# Altium project FTDI_JTAG_Prog_SOM_Bd.PrjPcb
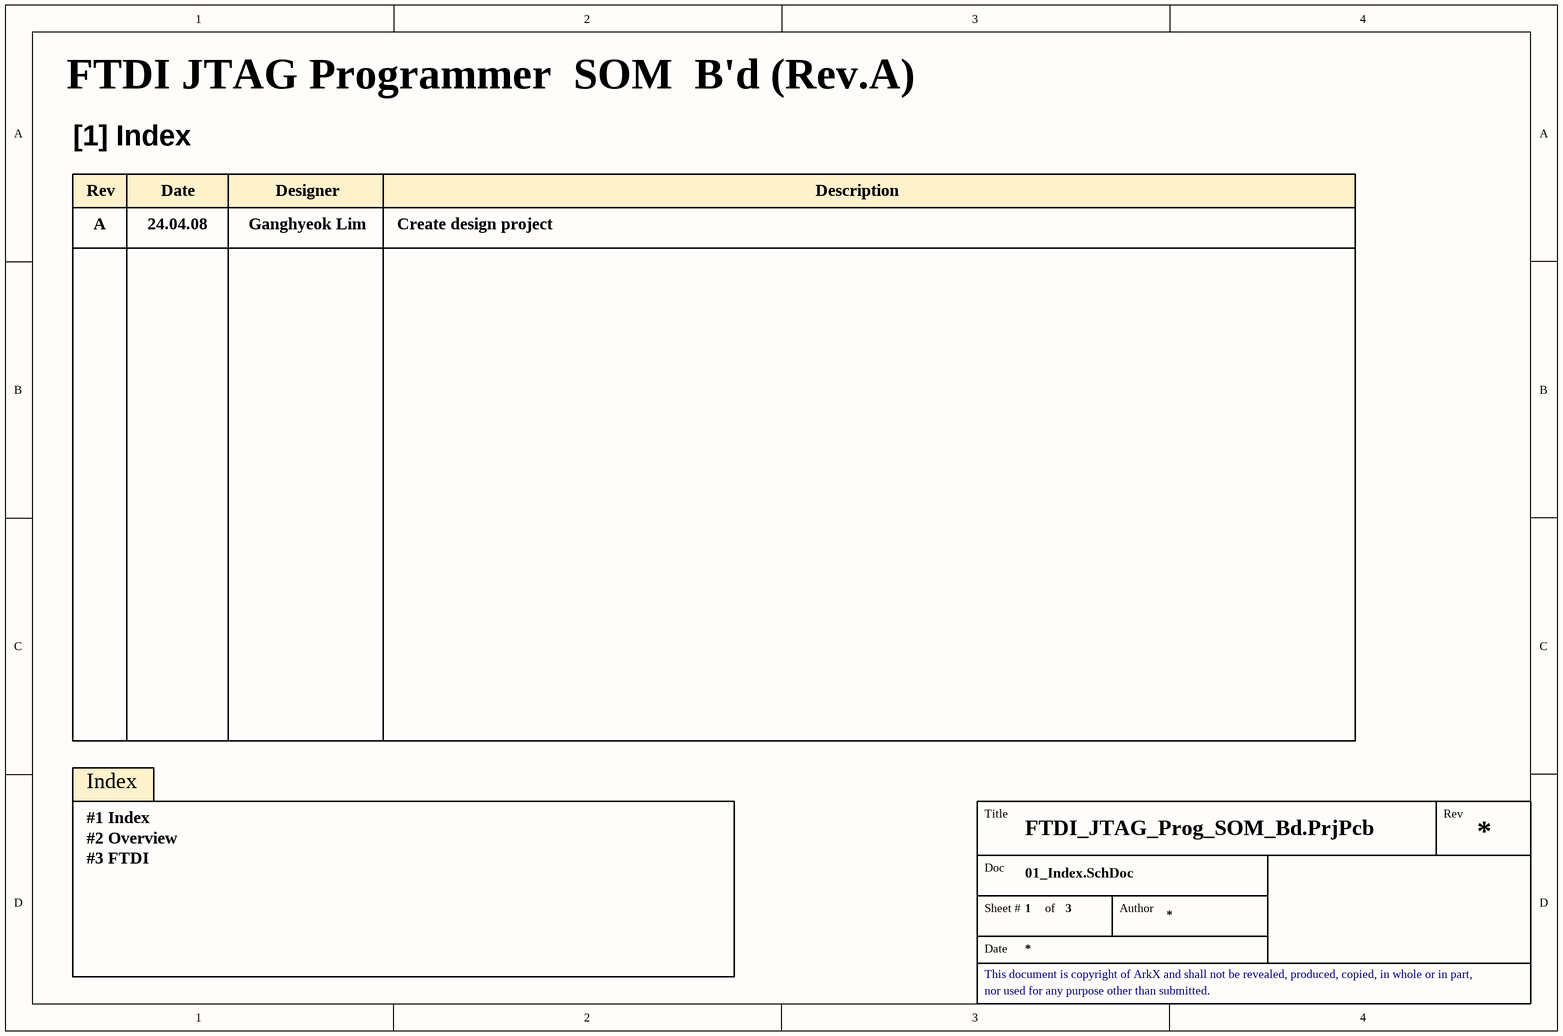
[diagram p0: 01_Index.SchDoc]
3 sheets, 53 parts. Net scope: global (net labels, ports and power ports of the same name join across sheets).
Board file: FTDI_JTAG_Prog_SOM_Bd.PcbDoc
Sheets:
  01_Index.SchDoc
  02_Overview.SchDoc
  03_FTDI.SchDoc

## Sheet 01_Index.SchDoc
size A4; SheetNumber: 1; SheetTotal: 3

### Notes on the sheet
- FTDI JTAG Programmer  SOM  B'd (Rev.A)
- [1] Index
- Rev
- A
- 24.04.08
- Date
- Ganghyeok Lim
- Designer
- Create design project
- Description
- Index
- #1 Index
- #2 Overview
- #3 FTDI
- Title
- Doc
- Sheet #
- of
- Author
- This document is copyright of ArkX and shall not be revealed, produced, copied, in whole or in part,
- nor used for any purpose other than submitted.

## Sheet 02_Overview.SchDoc
size A4; SheetNumber: 2; SheetTotal: 3
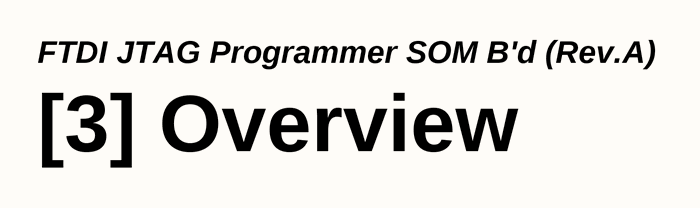
[diagram p1: 02_Overview.SchDoc]

### Notes on the sheet
- FTDI JTAG Programmer SOM B'd (Rev.A)
- [3] Overview
- Title
- Rev
- Doc
- Sheet #
- of
- Author
- This document is copyright of ArkX and shall not be revealed, produced, copied, in whole or in part,
- Date
- nor used for any purpose other than submitted.

## Sheet 03_FTDI.SchDoc
size A3; SheetNumber: 3; SheetTotal: 3
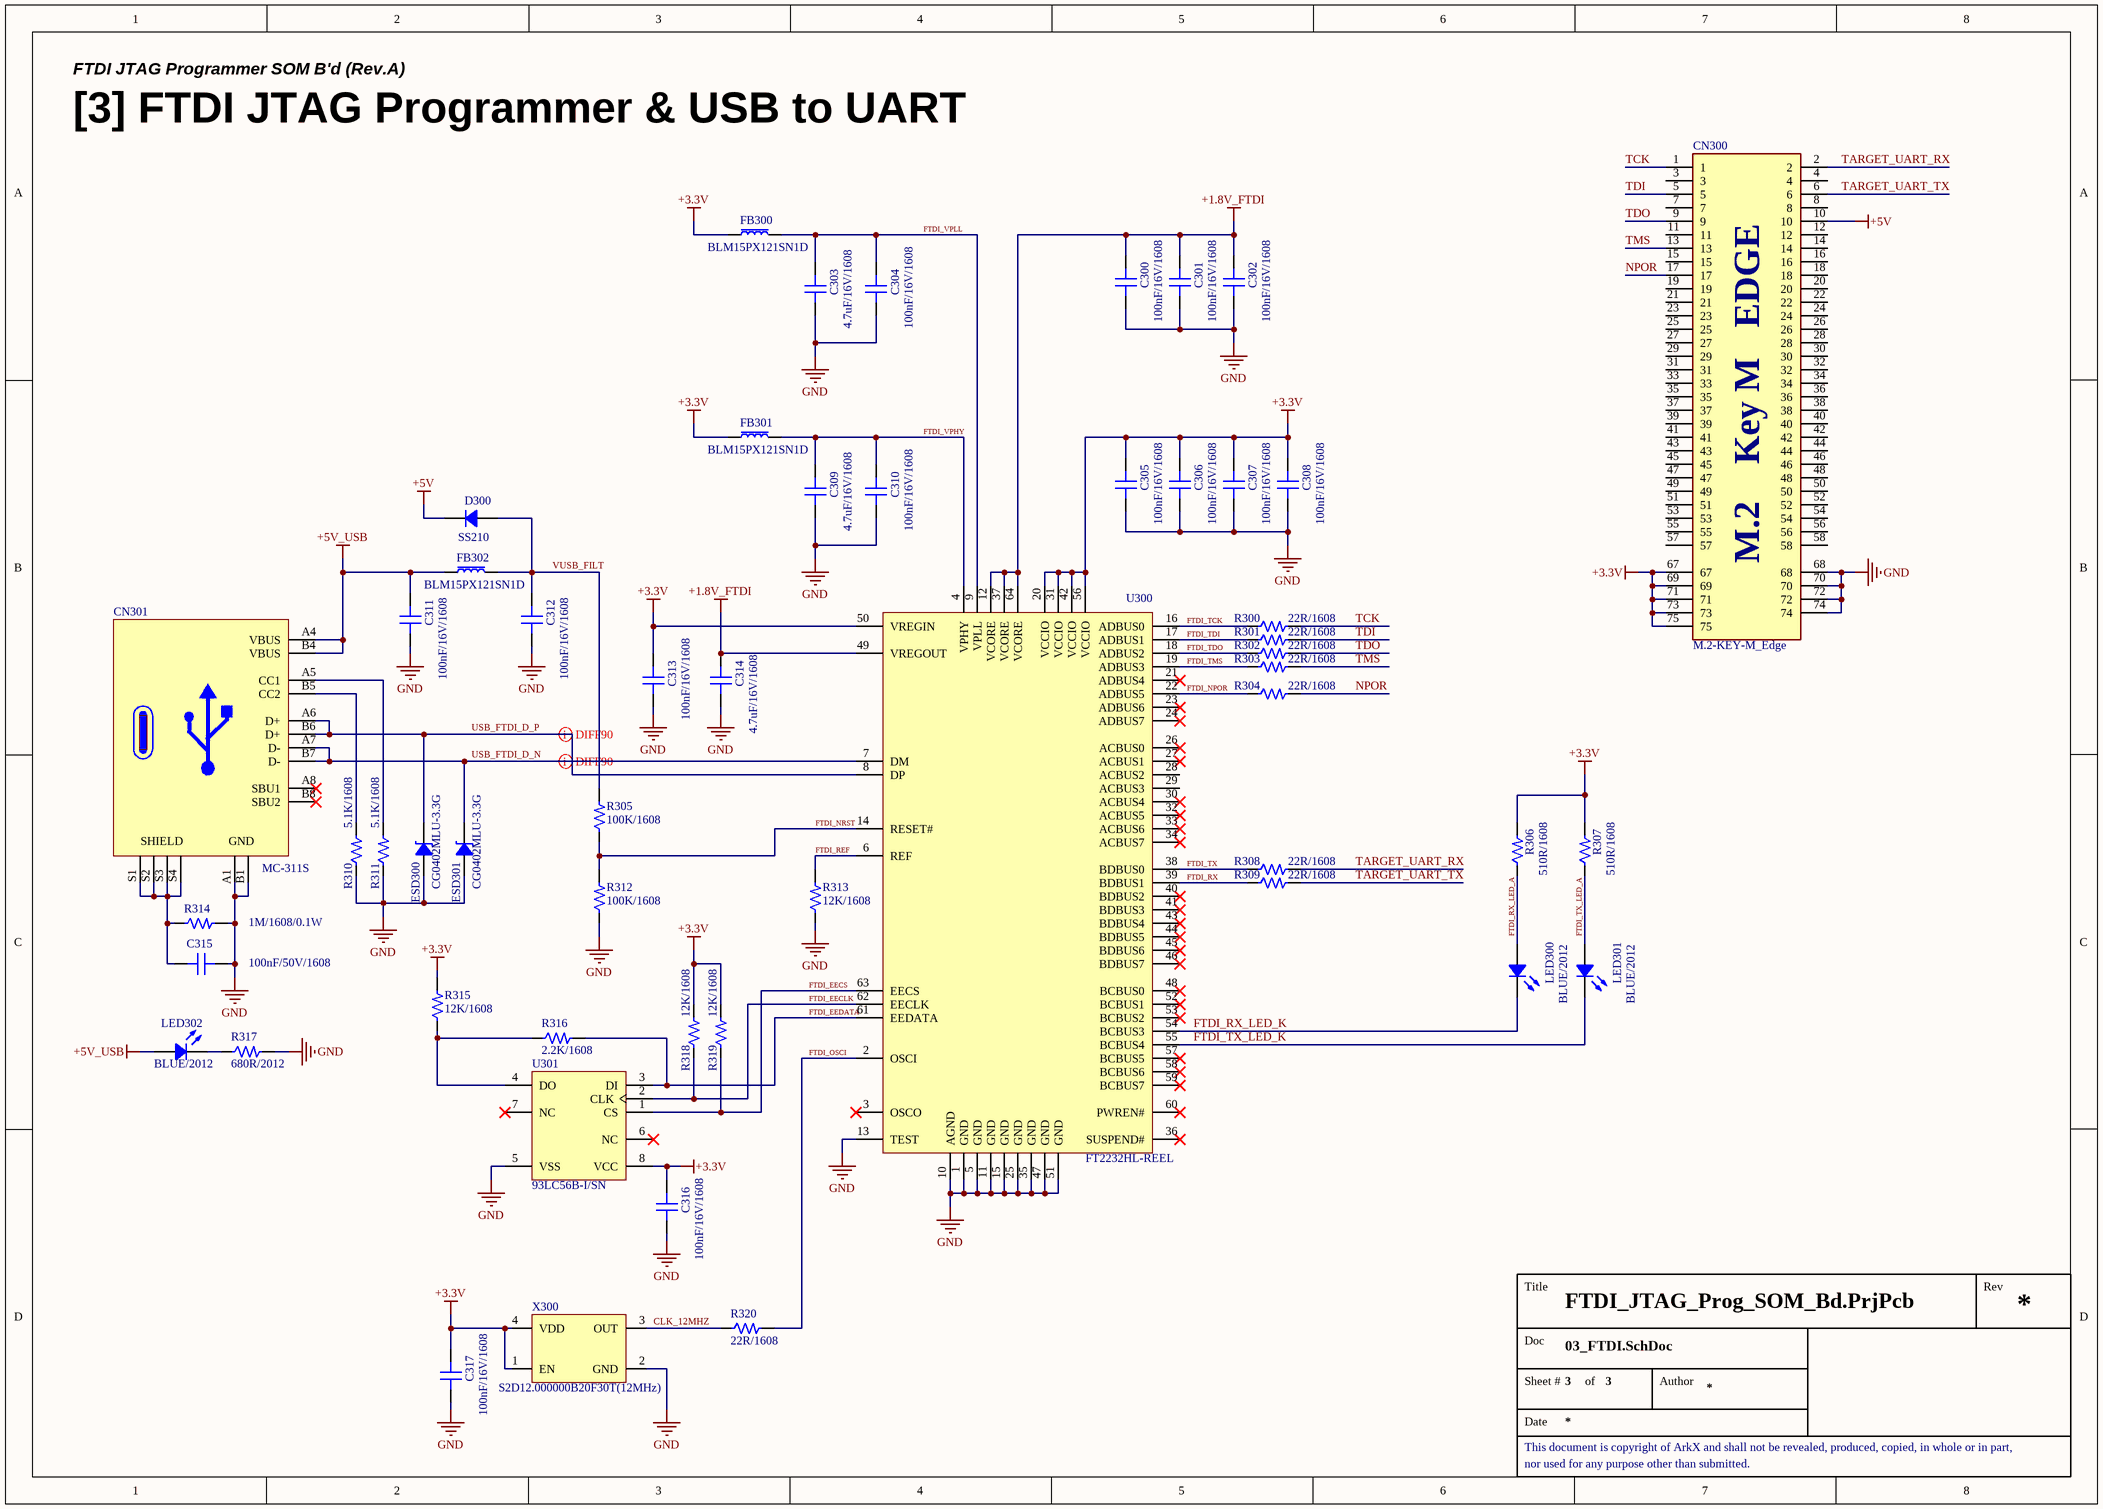
[diagram p2: 03_FTDI.SchDoc]

### Parts
C300  100nF/16V/1608  [CAP 1608 (0603_INCH)]
C301  100nF/16V/1608  [CAP 1608 (0603_INCH)]
C302  100nF/16V/1608  [CAP 1608 (0603_INCH)]
C303  4.7uF/16V/1608  [CAP 1608 (0603_INCH)]
C304  100nF/16V/1608  [CAP 1608 (0603_INCH)]
C305  100nF/16V/1608  [CAP 1608 (0603_INCH)]
C306  100nF/16V/1608  [CAP 1608 (0603_INCH)]
C307  100nF/16V/1608  [CAP 1608 (0603_INCH)]
C308  100nF/16V/1608  [CAP 1608 (0603_INCH)]
C309  4.7uF/16V/1608  [CAP 1608 (0603_INCH)]
C310  100nF/16V/1608  [CAP 1608 (0603_INCH)]
C311  100nF/16V/1608  [CAP 1608 (0603_INCH)]
C312  100nF/16V/1608  [CAP 1608 (0603_INCH)]
C313  100nF/16V/1608  [CAP 1608 (0603_INCH)]
C314  4.7uF/16V/1608  [CAP 1608 (0603_INCH)]
C315  100nF/50V/1608  [CAP 1608 (0603_INCH)]
C316  100nF/16V/1608  [CAP 1608 (0603_INCH)]
C317  100nF/16V/1608  [CAP 1608 (0603_INCH)]
CN300  M.2-KEY-M_Edge  [CON_M.2-KEY-M_MALE_22x80]  (no BOM)
CN301  MC-311S  [CON USB-Type-C (16P)]
D300  SS210  [DIO DO-214AC (SMA)]
ESD300  CG0402MLU-3.3G  [RES 1005 (0402_inch)]
ESD301  CG0402MLU-3.3G  [RES 1005 (0402_inch)]
FB300  BLM15PX121SN1D  [FB 1005 (0402_inch)]
FB301  BLM15PX121SN1D  [FB 1005 (0402_inch)]
FB302  BLM15PX121SN1D  [FB 1005 (0402_inch)]
LED300  BLUE/2012  [LED MHT170RGBCT (BLUE)]
LED301  BLUE/2012  [LED MHT170RGBCT (BLUE)]
LED302  BLUE/2012  [LED MHT170RGBCT (BLUE)]
R300  22R/1608  [RES 1608 (0603_inch)]
R301  22R/1608  [RES 1608 (0603_inch)]
R302  22R/1608  [RES 1608 (0603_inch)]
R303  22R/1608  [RES 1608 (0603_inch)]
R304  22R/1608  [RES 1608 (0603_inch)]
R305  100K/1608  [RES 1608 (0603_inch)]
R306  510R/1608  [RES 1608 (0603_inch)]
R307  510R/1608  [RES 1608 (0603_inch)]
R308  22R/1608  [RES 1608 (0603_inch)]
R309  22R/1608  [RES 1608 (0603_inch)]
R310  5.1K/1608  [RES 1608 (0603_inch)]
R311  5.1K/1608  [RES 1608 (0603_inch)]
R312  100K/1608  [RES 1608 (0603_inch)]
R313  12K/1608  [RES 1608 (0603_inch)]
R314  1M/1608/0.1W  [RES 1608 (0603_inch)]
R315  12K/1608  [RES 1608 (0603_inch)]
R316  2.2K/1608  [RES 1608 (0603_inch)]
R317  680R/2012  [RES 2012 (0805_inch)]
R318  12K/1608  [RES 1608 (0603_inch)]
R319  12K/1608  [RES 1608 (0603_inch)]
R320  22R/1608  [RES 1608 (0603_inch)]
U300  FT2232HL-REEL  [IC_LQFP-64-0.5mm]
U301  93LC56B-I/SN  [IC_SOIC-8 (4.90x3.90mm)]
X300  S2D12.000000B20F30T(12MHz)  [OSC SMD_2.5x2.0 (SCTF)]

### Nets
+1.8V_FTDI: C300.2 C301.2 C302.2 C314.2 U300.12(VCORE) U300.37(VCORE) U300.49(VREGOUT) U300.64(VCORE)
+3.3V: C305.2 C306.2 C307.2 C308.2 C313.2 C316.2 C317.2 CN300.67 CN300.69 CN300.71 CN300.73 CN300.75 FB300.1 FB301.1 R306.2 R307.2 R315.2 R318.2 R319.2 U300.20(VCCIO) U300.31(VCCIO) U300.42(VCCIO) U300.50(VREGIN) U300.56(VCCIO) U301.8(VCC) X300.1(EN) X300.4(VDD)
+5V: CN300.10 D300.2
+5V_USB: C311.2 CN301.A4(VBUS) CN301.B4(VBUS) FB302.1 LED302.4(Common_Anode)
GND: C300.1 C301.1 C302.1 C303.1 C304.1 C305.1 C306.1 C307.1 C308.1 C309.1 C310.1 C311.1 C312.1 C313.1 C314.1 C315.2 C316.1 C317.1 CN300.68 CN300.70 CN300.72 CN300.74 CN301.A1(GND) CN301.B1(GND) ESD300.1 ESD301.1 R310.1 R311.1 R312.1 R313.1 R314.2 R317.2 U300.1(GND) U300.5(GND) U300.10(AGND) U300.11(GND) U300.13(TEST) U300.15(GND) U300.25(GND) U300.35(GND) U300.47(GND) U300.51(GND) U301.5(VSS) X300.2(GND)
CLK_12MHZ: R320.1 X300.3(OUT)
FTDI_EECLK: R318.1 U300.62(EECLK) U301.2(CLK)
FTDI_EECS: R319.1 U300.63(EECS) U301.1(CS)
FTDI_EEDATA: R316.2 U300.61(EEDATA) U301.3(DI)
FTDI_NPOR: R304.1 U300.22(ADBUS5)
FTDI_NRST: R305.1 R312.2 U300.14(RESET#)
FTDI_OSCI: R320.2 U300.2(OSCI)
FTDI_REF: R313.2 U300.6(REF)
FTDI_RX: R309.1 U300.39(BDBUS1)
FTDI_RX_LED_A: LED300.4(Common_Anode) R306.1
FTDI_RX_LED_K: LED300.3(BLUE) U300.54(BCBUS3)
FTDI_TCK: R300.1 U300.16(ADBUS0)
FTDI_TDI: R301.1 U300.17(ADBUS1)
FTDI_TDO: R302.1 U300.18(ADBUS2)
FTDI_TMS: R303.1 U300.19(ADBUS3)
FTDI_TX: R308.1 U300.38(BDBUS0)
FTDI_TX_LED_A: LED301.4(Common_Anode) R307.1
FTDI_TX_LED_K: LED301.3(BLUE) U300.55(BCBUS4)
FTDI_VPHY: C309.2 C310.2 FB301.2 U300.4(VPHY)
FTDI_VPLL: C303.2 C304.2 FB300.2 U300.9(VPLL)
NPOR: CN300.17 R304.2
TARGET_UART_RX: CN300.2 R308.2
TARGET_UART_TX: CN300.6 R309.2
TCK: CN300.1 R300.2
TDI: CN300.5 R301.2
TDO: CN300.9 R302.2
TMS: CN300.13 R303.2
USB_FTDI_D_N: CN301.A7(D-) CN301.B7(D-) ESD301.2 U300.7(DM)
USB_FTDI_D_P: CN301.A6(D+) CN301.B6(D+) ESD300.2 U300.8(DP)
VUSB_FILT: C312.2 D300.1 FB302.2 R305.2
NetC315_1: C315.1 CN301.S1(SHIELD) CN301.S2(SHIELD) CN301.S3(SHIELD) CN301.S4(SHIELD) R314.1
NetCN301_A5: CN301.A5(CC1) R311.2
NetCN301_B5: CN301.B5(CC2) R310.2
NetLED302_3: LED302.3(BLUE) R317.1
NetR315_1: R315.1 R316.1 U301.4(DO)

Not connected (* = marked no-connect by the designer): CN300 3 4 7 8 11 12 14 15 16 18 19 20 21 22 23 24 25 26 27 28 29 30 31 32 33 34 35 36 37 38 39 40 41 42 43 44 45 46 47 48 49 50 51 52 53 54 55 56 57 58; CN301 A8(SBU1)* B8(SBU2)*; U300 3(OSCO)* 21(ADBUS4)* 23(ADBUS6)* 24(ADBUS7)* 26(ACBUS0)* 27(ACBUS1)* 28(ACBUS2) 29(ACBUS3) 30(ACBUS4)* 32(ACBUS5)* 33(ACBUS6)* 34(ACBUS7)* 36(SUSPEND#)* 40(BDBUS2)* 41(BDBUS3)* 43(BDBUS4)* 44(BDBUS5)* 45(BDBUS6)* 46(BDBUS7)* 48(BCBUS0)* 52(BCBUS1)* 53(BCBUS2)* 57(BCBUS5)* 58(BCBUS6)* 59(BCBUS7)* 60(PWREN#)*; U301 6(NC)* 7(NC)*

### Layout directives
differential pair; differential pair class DIFF90: USB_FTDI_D_N, USB_FTDI_D_P

### Notes on the sheet
- FTDI JTAG Programmer SOM B'd (Rev.A)
- [3] FTDI JTAG Programmer & USB to UART
- Title
- Rev
- Doc
- Sheet #
- of
- Author
- This document is copyright of ArkX and shall not be revealed, produced, copied, in whole or in part,
- Date
- nor used for any purpose other than submitted.
- (in symbol CON_M.2-KEY-M_MALE) EDGE; Key M; M.2

### Library data of the parts
C300-C302 C304-C308 C310-C313 C316 C317 = CAP_100nF/16V/1608: Ceramic CAP_100nF/16V/1608; LCSC Part #: C66501; JLCPCB Part Type: Extended Part
C303 C309 C314 = CAP_4.7uF/16V/1608: Ceramic CAP_4.7uF/16V/1608; LCSC Part #: C19666; JLCPCB Part Type: Basic Part
C315 = CAP_100nF/50V/1608: Ceramic CAP_100nF/50V/1608; LCSC Part #: C14663; JLCPCB Part Type: Basic Part
CN300 = CON_M.2-KEY-M_MALE: M.2 Key M Edge
CN301 = CON_USB-Type-C: USB 2.0 5A 1 Surface Mount 16 Female -35℃~+75℃ Type-C SMD  USB Connectors ROHS; LCSC Part #: C2977718; JLCPCB Part Type: Extended Part
D300 = DIO_SS210: 100V 850mV@2A 2A SMA(DO-214AC)  Schottky Barrier Diodes (SBD) ROHS; LCSC Part #: C14996; JLCPCB Part Type: Basic Part
ESD300 ESD301 = ESD_CG0402MLU-3.3G: Varistor 1 Circuit Surface Mount, MLCV 0402 (1005 Metric); LCSC Part #: C2655393; JLCPCB Part Type: Extended Part
FB300-FB302 = FB_BLM15PX121SN1D: 55mΩ ±25% 120Ω@100MHz 0402  Ferrite Beads ROHS; LCSC Part #: C88970; JLCPCB Part Type: Extended Part
LED300-LED302 = LED_MHT170RGBCT(BLUE): Colorless transparence -30℃~+85℃ Positive post Common anode RGB 120° 0805  Light Emitting Diodes (LED) ROHS; LCSC Part #: C2962094; JLCPCB Part Type: Extended Part
R300-R304 R308 R309 R320 = RES_22R/1608/0.1W: Value: 22R; Power Rating: 0.1W; Precision: 1%; Size: 1608; LCSC Part #: C23345; JLCPCB Part Type: Basic Part
R305 R312 = RES_100K/1608/0.1W: Value: 100K; Power Rating: 0.1W; Precision: 1%; Size: 1608; LCSC Part #: C25803; JLCPCB Part Type: Basic Part
R306 R307 = RES_510R/1608/0.1W: Value: 510R; Power Rating: 0.1W; Precision: 1%; Size: 1608; LCSC Part #: C23193; JLCPCB Part Type: Basic Part
R310 R311 = RES_5.1K/1608/0.1W: Value: 5.1K; Power Rating: 0.1W; Precision: 1%; Size: 1608; LCSC Part #: C23186; JLCPCB Part Type: Basic Part
R313 R315 R318 R319 = RES_12K/1608/0.1W: Value: 12K; Power Rating: 0.1W; Precision: 1%; Size: 1608; LCSC Part #: C22790; JLCPCB Part Type: Basic Part
R314 = RES_1M/1608/0.1W: Value: 1M; Power Rating: 0.1W; Precision: 1%; Size: 1608; LCSC Part #: C22935; JLCPCB Part Type: Basic Part
R316 = RES_2.2K/1608/0.1W: Value: 2.2K; Power Rating: 0.1W; Precision: 1%; Size: 1608; LCSC Part #: C4190; JLCPCB Part Type: Basic Part
R317 = RES_680R/2012/0.125W: Value: 680R; Power Rating: 0.125W; Precision: 1%; Size: 2012; LCSC Part #: C17798; JLCPCB Part Type: Basic Part
U300 = IC_USB_FT2232HL-REEL: USB Bridge, USB to UART,FIFO USB 2.0 UART Interface 64-LQFP (10x10); LCSC Part #: C27882; JLCPCB Part Type: Extended Part
U301 = IC_EEPROM_93LC56B-I/SN: EEPROM Memory IC 2Kbit Microwire 2 MHz 8-SOIC; LCSC Part #: C183620; JLCPCB Part Type: Extended Part
X300 = OSC_S2D12.000000B20F30T(12MHz): 3.3V~3.3V -40℃~+85℃ 20mA ±20ppm 12MHz SMD2520-4P  Oscillators ROHS; LCSC Part #: C387449; JLCPCB Part Type: Extended Part